# Altium project sensornode_v2.PrjPcb
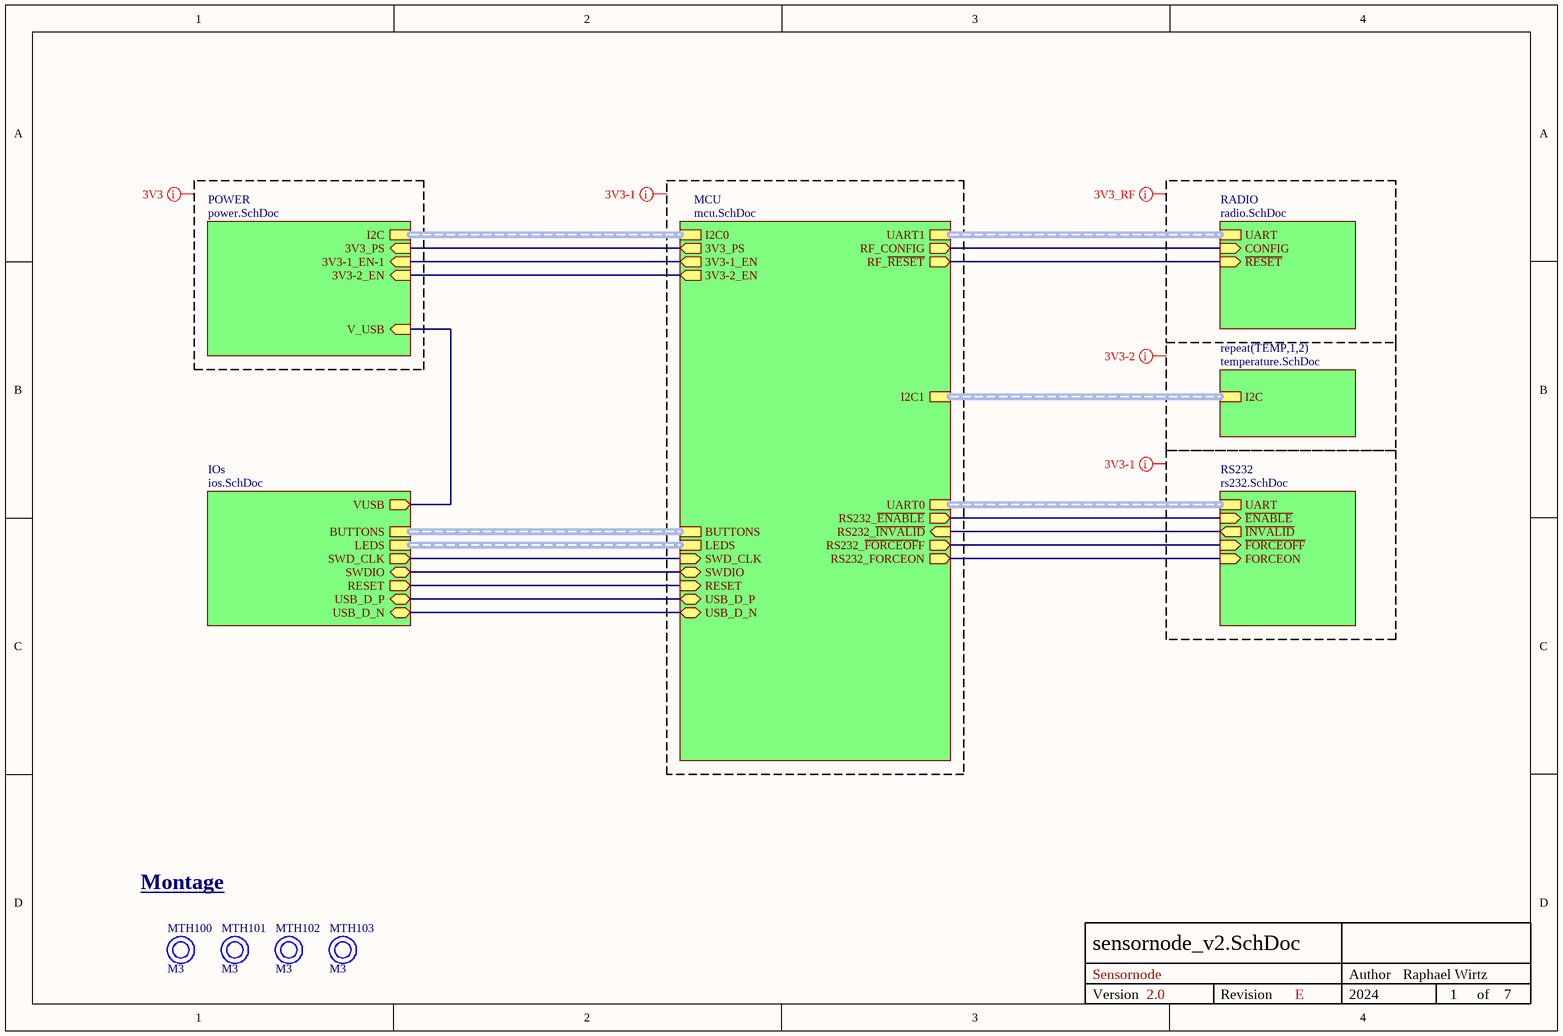
[diagram p0: sensornode_v2.SchDoc]
DateCustom: 2024; ProjectAuthorCustom: Raphael Wirtz; ProjectNameCustom: Sensornode; ProjectRevisionCustom: E; ProjectVersionCustom: 2.0
6 sheets, 113 parts. Net scope: hierarchical (ports join the sheet entries above them; power ports are global).
Board files: sensornode_poc_rtc.PcbDoc, sensornode_v2.PcbDoc
Sheets:
  sensornode_v2.SchDoc
    MCU = mcu.SchDoc
    POWER = power.SchDoc
    RADIO = radio.SchDoc
    TEMP1 = temperature.SchDoc
    TEMP2 = temperature.SchDoc
    IOs = ios.SchDoc

## Sheet sensornode_v2.SchDoc
size A4; DocumentNumber: 1; SheetNumber: 1; SheetTotal: 7

### Parts
MTH100  M3  (mechanical)
MTH101  M3  (mechanical)
MTH102  M3  (mechanical)
MTH103  M3  (mechanical)

### Sub-sheets
IOs = ios.SchDoc: RESET (out), USB_D_N (bidir), USB_D_P (bidir), LEDS (harness LED), BUTTONS (harness BUTTONS), SWDIO (bidir), SWD_CLK (out), VUSB (out)
MCU = mcu.SchDoc: I2C0 (harness I2C0), UART1 (harness UART0), UART0 (harness UART1), I2C1 (harness I2C1), RF_CONFIG (out), RF_~{RESET} (out), 3V3_PS (out), SWD_CLK (in), SWDIO (bidir), RESET (in), USB_D_N (bidir), USB_D_P (bidir), RS232_~{ENABLE} (out), RS232_~{INVALID} (in), BUTTONS (harness BUTTONS), LEDS (harness LED), 3V3-1_EN (out), 3V3-2_EN (out), RS232_~{FORCEOF}F (out), RS232_FORCEON (out)
POWER = power.SchDoc: 3V3_PS (in), I2C (harness I2C), V_USB (in), 3V3-2_EN (in), 3V3-1_EN-1 (in)
RADIO = radio.SchDoc: UART (harness UART), CONFIG (in), ~{RESET} (in)
repeat(TEMP,1,2) = temperature.SchDoc: I2C (harness I2C_Temp)
RS232 = rs232.SchDoc (file not in this document): UART (harness UART_RS232), ~{ENABLE} (in), ~{INVALID} (out), ~{FORCEOFF} (in), FORCEON (in)

### Nets
~{RF_RESET}: sheet MCU/RF_~{RESET}, sheet RADIO/~{RESET}
CONFIG: sheet MCU/RF_CONFIG, sheet RADIO/CONFIG
LED_2: sheet MCU/3V3-1_EN, sheet POWER/3V3-1_EN-1
POWER_3V3-2_EN: sheet MCU/3V3-2_EN, sheet POWER/3V3-2_EN
POWER_3V3_PS: sheet MCU/3V3_PS, sheet MCU/RS232_~{FORCEOF}F, sheet POWER/3V3_PS, sheet RS232/~{FORCEOFF}
RESET: sheet MCU/RESET, sheet IOs/RESET
RS232_~{ENABLE}: sheet MCU/RS232_~{ENABLE}, sheet RS232/~{ENABLE}
RS232_FORCEON: sheet MCU/RS232_FORCEON, sheet RS232/FORCEON
RS232_~{INVALID}: sheet MCU/RS232_~{INVALID}, sheet RS232/~{INVALID}
SWD_CLK: sheet MCU/SWD_CLK, sheet IOs/SWD_CLK
SWDIO: sheet MCU/SWDIO, sheet IOs/SWDIO
USB_D_N: sheet MCU/USB_D_N, sheet IOs/USB_D_N
USB_D_P: sheet MCU/USB_D_P, sheet IOs/USB_D_P
V_USB: sheet POWER/V_USB, sheet IOs/VUSB

### Buses and harness runs
harness sheet IOs/BUTTONS = sheet MCU/BUTTONS
harness sheet IOs/LEDS = sheet MCU/LEDS
harness sheet MCU/I2C0 = sheet POWER/I2C
harness sheet MCU/I2C1 = sheet repeat(TEMP,1,2)/I2C
harness sheet MCU/UART0 = sheet RS232/UART
harness sheet MCU/UART1 = sheet RADIO/UART

### Layout directives
net class 3V3: (no net found under the mark)
net class 3V3-2: (no net found under the mark)
net class 3V3-1: (no net found under the mark)

### Notes on the sheet
- Montage
- Author
- Version
- Revision
- of

### Library data of the parts
MTH100-MTH103 = MOUNT_TH: Value: M3

## Sheet mcu.SchDoc
size A3; DocumentNumber: 3; SheetNumber: 3; SheetTotal: 7
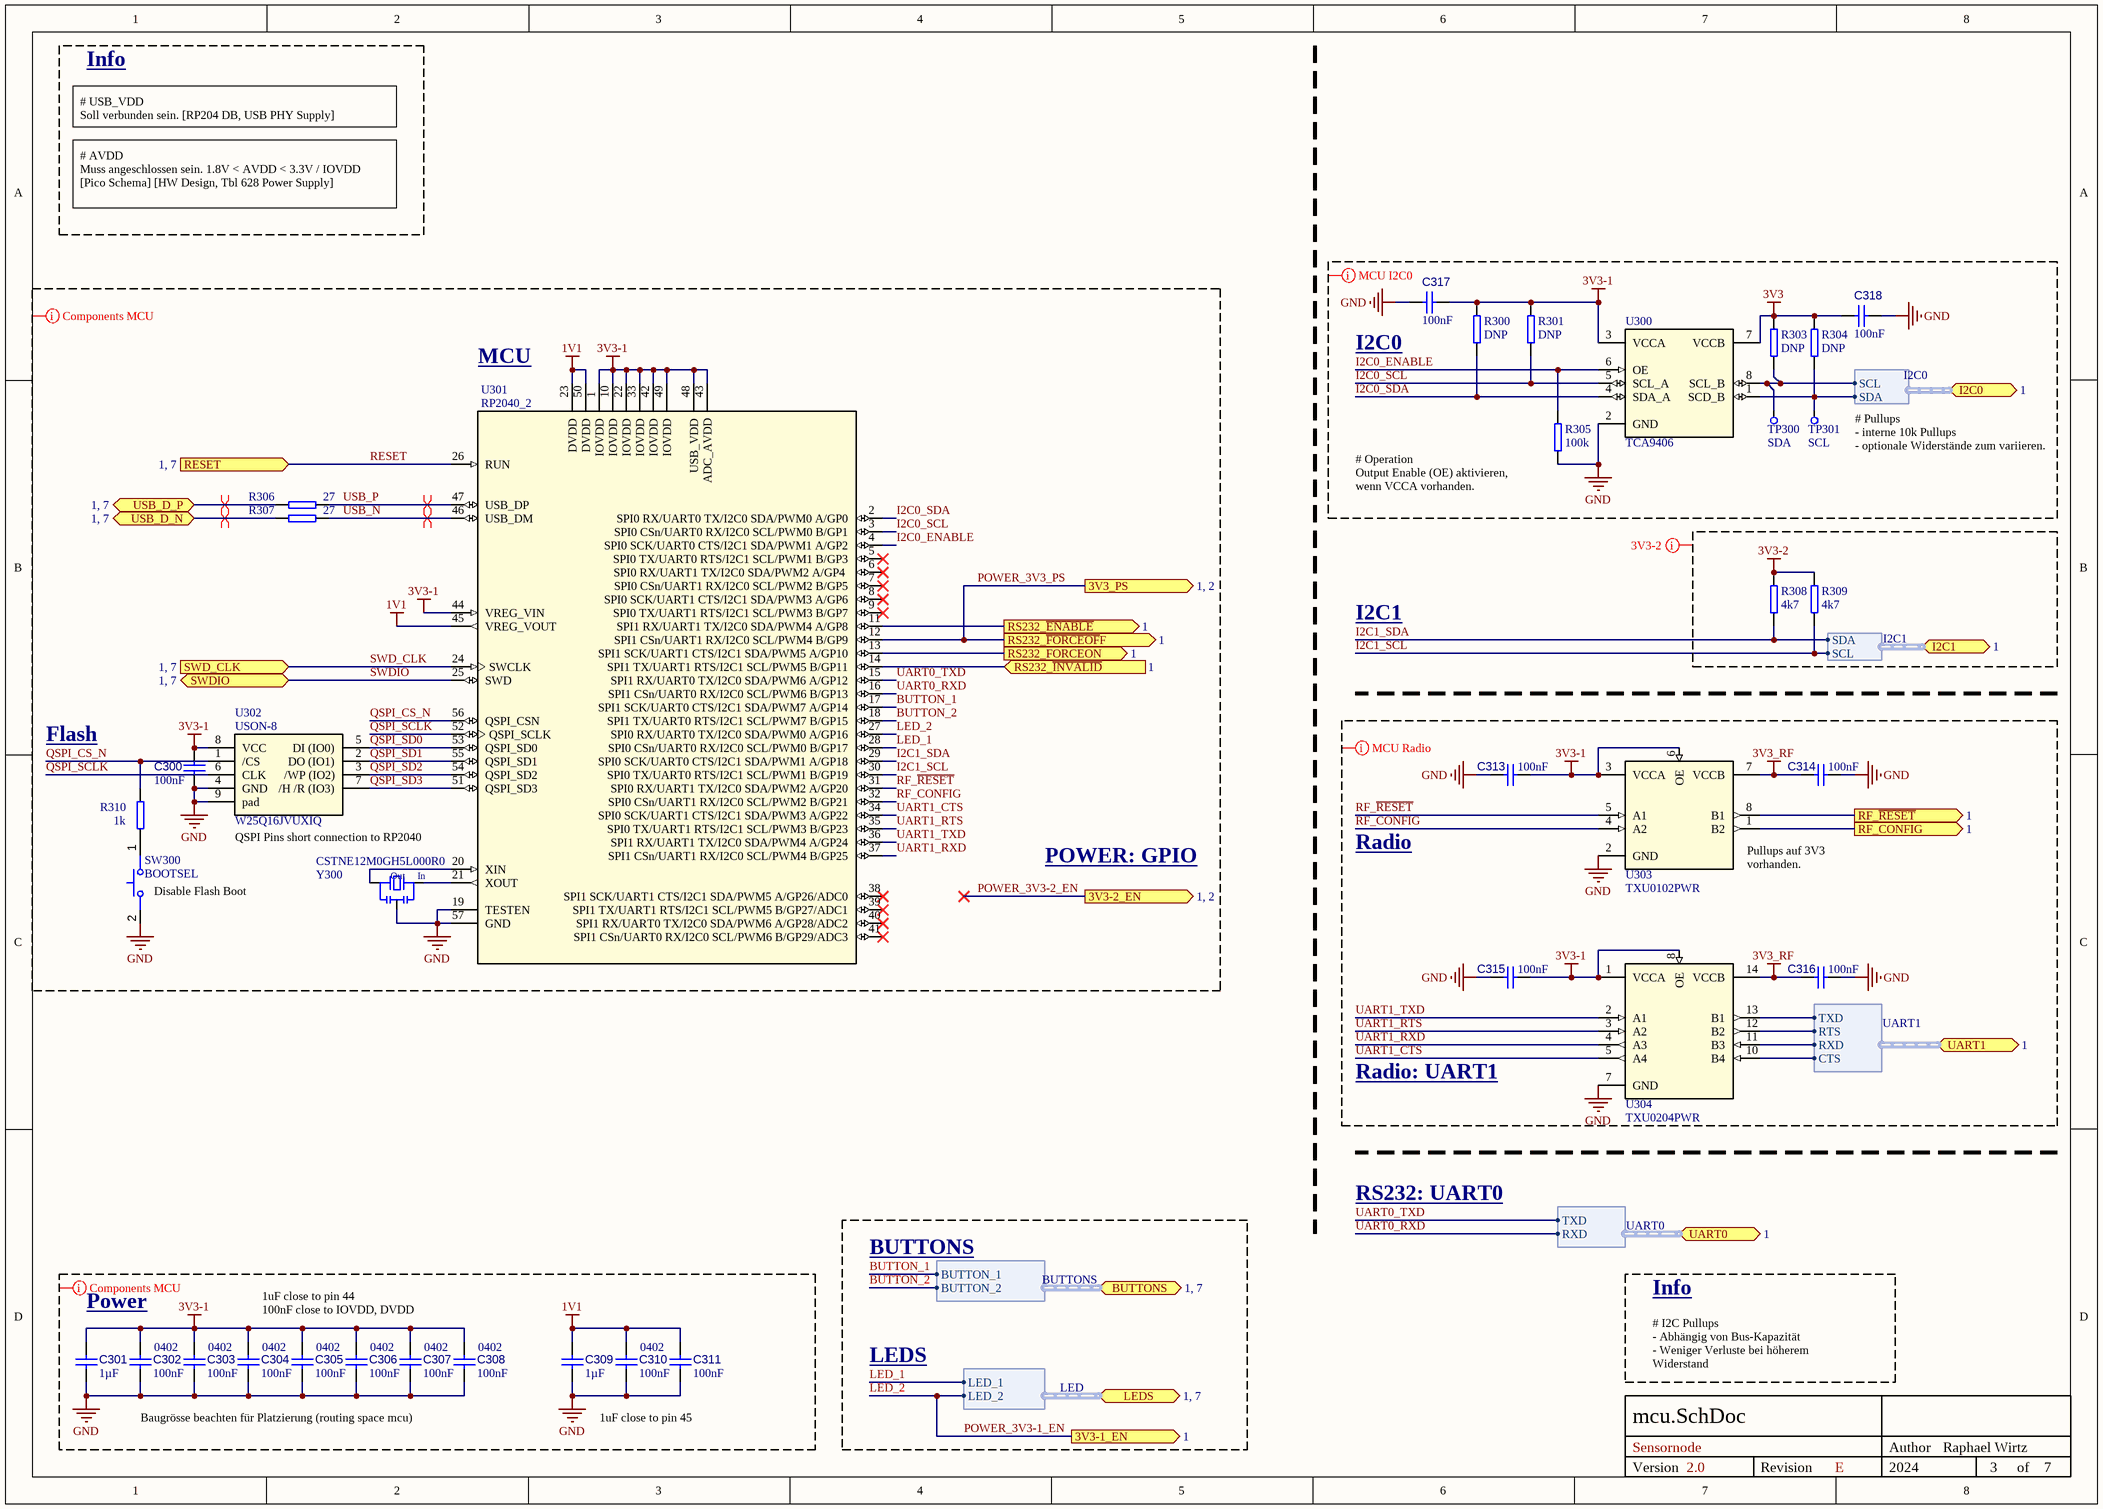
[diagram p1: mcu.SchDoc]

### Parts
C300  value 100nF  [0402]  (hidden comment: Capacitor 0402)
C301  1µF  [0402]
C302  value 100nF  [0402]  (hidden comment: Capacitor 0402)
C303  value 100nF  [0402]  (hidden comment: Capacitor 0402)
C304  value 100nF  [0402]  (hidden comment: Capacitor 0402)
C305  value 100nF  [0402]  (hidden comment: Capacitor 0402)
C306  value 100nF  [0402]  (hidden comment: Capacitor 0402)
C307  value 100nF  [0402]  (hidden comment: Capacitor 0402)
C308  value 100nF  [0402]  (hidden comment: Capacitor 0402)
C309  1µF  [0402]
C310  value 100nF  [0402]  (hidden comment: Capacitor 0402)
C311  value 100nF  [0402]  (hidden comment: Capacitor 0402)
C313  value 100nF  [0603]
C314  value 100nF  [0603]
C315  value 100nF  [0603]
C316  value 100nF  [0603]
C317  value 100nF  [0603]
C318  value 100nF  [0603]
R300  DNP  [0603]
R301  DNP  [0603]
R303  DNP  [0603]
R304  DNP  [0603]
R305  100k  [0603]
R306  27  [0603]
R307  27  [0603]
R308  4k7  [0603]
R309  4k7  [0603]
R310  1k  [0603]
SW300  BOOTSEL  [SWITCH_B3FS1010P]
TP300  Name: SDA  [TP+245X165]  (hidden comment: TP_SMD)
TP301  Name: SCL  [TP+245X165]  (hidden comment: TP_SMD)
U300  TCA9406  [VSSOP_SOP50P310X90-8N]
U301  RP2040_2  [QFN40P700X700X90-57N]
U302  W25Q16JVUXIQ  Case: USON-8  [SON50P300X200X60-9N]
U303  TXU0102PWR  [VFSOP-8]
U304  TXU0204PWR  [TSSOP-14]
Y300  CSTNE12M0GH5L000R0  [OSC_CSTNE12M0GH5L000R0]

### Ports
3V3-1_EN (out, see 1), 3V3-2_EN (out, see 1, 2), 3V3_PS (out, see 1, 2), BUTTONS (bidir, harness BUTTONS, see 1, 7), I2C0 (bidir, harness I2C0, see 1), I2C1 (bidir, harness I2C1, see 1), LEDS (bidir, harness LED, see 1, 7), RESET (in, see 1, 7), RF_CONFIG (out, see 1), RF_~{RESET} (out, see 1), RS232_FORCEON (out, see 1), RS232_~{ENABLE} (out, see 1), RS232_~{FORCEOF}F (out, see 1), RS232_~{INVALID} (in, see 1), SWD_CLK (in, see 1, 7), SWDIO (bidir, see 1, 7), UART0 (bidir, harness UART0, see 1), UART1 (bidir, harness UART1, see 1), USB_D_N (bidir, see 1, 7), USB_D_P (bidir, see 1, 7)

### Harnesses
I2C1: SDA, SCL
I2C0: SDA, SCL
UART0: TXD, RXD
UART1: CTS, RTS, TXD, RXD
BUTTONS: BUTTON_1, BUTTON_2
LED: LED_2, LED_1

### Nets
1V1: C309.1 C310.1 C311.1 U301.23(DVDD) U301.45(VREG_VOUT) U301.50(DVDD)
3V3: C318.2 R303.1 R304.1 U300.7(VCCB)
3V3-1: C300.1 C301.1 C302.1 C303.1 C304.1 C305.1 C306.1 C307.1 C308.1 C313.2 C315.2 C317.1 R300.1 R301.1 U300.3(VCCA) U301.1(IOVDD) U301.10(IOVDD) U301.22(IOVDD) U301.33(IOVDD) U301.42(IOVDD) U301.43(ADC_AVDD) U301.44(VREG_VIN) U301.48(USB_VDD) U301.49(IOVDD) U302.8(VCC) U303.3(VCCA) U303.6(OE) U304.1(VCCA) U304.8(OE)
3V3-2: R308.1 R309.1
3V3_RF: C314.1 C316.1 U303.7(VCCB) U304.14(VCCB)
GND: C300.2 C301.2 C302.2 C303.2 C304.2 C305.2 C306.2 C307.2 C308.2 C309.2 C310.2 C311.2 C313.1 C314.2 C315.1 C316.2 C317.2 C318.1 R305.2 SW300.2 U300.2(GND) U301.19(TESTEN) U301.57(GND) U302.4(GND) U302.9(pad) U303.2(GND) U304.7(GND) Y300.2(GND)
~{RF_RESET}: U303.8(B1) ; port RF_~{RESET}
BUTTON_1: U301.17(SPI1_SCK/UART0_CTS/I2C1_SDA/PWM7_A/GP14) ; port BUTTONS.BUTTON_1
BUTTON_2: U301.18(SPI1_TX/UART0_RTS/I2C1_SCL/PWM7_B/GP15) ; port BUTTONS.BUTTON_2
CONFIG: U303.1(B2) ; port RF_CONFIG
I2C0_ENABLE: R305.1 U300.6(OE) U301.4(SPI0_SCK/UART0_CTS/I2C1_SDA/PWM1_A/GP2)
I2C0_SCL: R301.2 U300.5(SCL_A) U301.3(SPI0_CSn/UART0_RX/I2C0_SCL/PWM0_B/GP1)
I2C0_SDA: R300.2 U300.4(SDA_A) U301.2(SPI0_RX/UART0_TX/I2C0_SDA/PWM0_A/GP0)
I2C1_SCL: R309.2 U301.30(SPI0_TX/UART0_RTS/I2C1_SCL/PWM1_B/GP19) ; port I2C1.SCL
I2C1_SDA: R308.2 U301.29(SPI0_SCK/UART0_CTS/I2C1_SDA/PWM1_A/GP18) ; port I2C1.SDA
LED_1: U301.28(SPI0_CSn/UART0_RX/I2C0_SCL/PWM0_B/GP17) ; port LEDS.LED_1
LED_2: U301.27(SPI0_RX/UART0_TX/I2C0_SDA/PWM0_A/GP16) ; port 3V3-1_EN, port LEDS.LED_2  [also labelled POWER_3V3-1_EN]
POWER_3V3_PS: U301.12(SPI1_CSn/UART1_RX/I2C0_SCL/PWM4_B/GP9) ; port 3V3_PS, port RS232_~{FORCEOF}F
QSPI_CS_N: R310.2 U301.56(QSPI_CSN) U302.1(/CS)
QSPI_SCLK: U301.52(QSPI_SCLK) U302.6(CLK)
QSPI_SD0: U301.53(QSPI_SD0) U302.5(DI_(IO0))
QSPI_SD1: U301.55(QSPI_SD1) U302.2(DO_(IO1))
QSPI_SD2: U301.54(QSPI_SD2) U302.3(/WP_(IO2))
QSPI_SD3: U301.51(QSPI_SD3) U302.7(/H_/R_(IO3))
RESET: U301.26(RUN) ; port RESET
RF_CONFIG: U301.32(SPI0_CSn/UART1_RX/I2C0_SCL/PWM2_B/GP21) U303.4(A2)
RF_~{RESET}: U301.31(SPI0_RX/UART1_TX/I2C0_SDA/PWM2_A/GP20) U303.5(A1)
RF_RXD: U304.11(B3) ; port UART1.RXD
RF_TXD: U304.13(B1) ; port UART1.TXD
RS232_~{ENABLE}: U301.11(SPI1_RX/UART1_TX/I2C0_SDA/PWM4_A/GP8) ; port RS232_~{ENABLE}
RS232_FORCEON: U301.13(SPI1_SCK/UART1_CTS/I2C1_SDA/PWM5_A/GP10) ; port RS232_FORCEON
RS232_~{INVALID}: U301.14(SPI1_TX/UART1_RTS/I2C1_SCL/PWM5_B/GP11) ; port RS232_~{INVALID}
SWD_CLK: U301.24(SWCLK) ; port SWD_CLK
SWDIO: U301.25(SWD) ; port SWDIO
UART0_RXD: U301.16(SPI1_CSn/UART0_RX/I2C0_SCL/PWM6_B/GP13) ; port UART0.RXD
UART0_TXD: U301.15(SPI1_RX/UART0_TX/I2C0_SDA/PWM6_A/GP12) ; port UART0.TXD
UART1_CTS: U301.34(SPI0_SCK/UART1_CTS/I2C1_SDA/PWM3_A/GP22) U304.5(A4)
UART1_RTS: U301.35(SPI0_TX/UART1_RTS/I2C1_SCL/PWM3_B/GP23) U304.3(A2)
UART1_RXD: U301.37(SPI1_CSn/UART1_RX/I2C0_SCL/PWM4_B/GP25) U304.4(A3)
UART1_TXD: U301.36(SPI1_RX/UART1_TX/I2C0_SDA/PWM4_A/GP24) U304.2(A1)
USB_D_N: R307.2 ; port USB_D_N
USB_D_P: R306.2 ; port USB_D_P
USB_N: R307.1 U301.46(USB_DM)
USB_P: R306.1 U301.47(USB_DP)
NetR303_2: R303.2 TP300.1 U300.8(SCL_B) ; port I2C0.SCL
NetR304_2: R304.2 TP301.1 U300.1(SCD_B) ; port I2C0.SDA
NetR310_1: R310.1 SW300.1
NetU301_20: U301.20(XIN) Y300.3
NetU301_21: U301.21(XOUT) Y300.1
NetU304_10: U304.10(B4) ; port UART1.CTS
NetU304_12: U304.12(B2) ; port UART1.RTS

Not connected (* = marked no-connect by the designer): U301 5(SPI0_TX/UART0_RTS/I2C1_SCL/PWM1_B/GP3)* 6(SPI0_RX/UART1_TX/I2C0_SDA/PWM2_A/GP4)* 7(SPI0_CSn/UART1_RX/I2C0_SCL/PWM2_B/GP5)* 8(SPI0_SCK/UART1_CTS/I2C1_SDA/PWM3_A/GP6)* 9(SPI0_TX/UART1_RTS/I2C1_SCL/PWM3_B/GP7)* 38(SPI1_SCK/UART1_CTS/I2C1_SDA/PWM5_A/GP26/ADC0)* 39(SPI1_TX/UART1_RTS/I2C1_SCL/PWM5_B/GP27/ADC1)* 40(SPI1_RX/UART0_TX/I2C0_SDA/PWM6_A/GP28/ADC2)* 41(SPI1_CSn/UART0_RX/I2C0_SCL/PWM6_B/GP29/ADC3)*

### Layout directives
differential pair: USB_D_N, USB_D_P, USB_N, USB_P
net class 3V3-2: 3V3-2
CompClassName: MCU_MCU: 1V1, 3V3-1, BUTTON_1, BUTTON_2, GND, I2C0_ENABLE, I2C0_SCL, I2C0_SDA, I2C1_SCL, I2C1_SDA, LED_1, LED_2, POWER_3V3-2_EN, POWER_3V3_PS, QSPI_CS_N, QSPI_SCLK, QSPI_SD0, QSPI_SD1, QSPI_SD2, QSPI_SD3, RESET, RF_CONFIG, RF_~{RESET}, SWD_CLK, SWDIO, UART0_RXD, UART0_TXD, UART1_CTS, UART1_RTS, UART1_RXD, UART1_TXD, USB_N, USB_P
CompClassName: MCU_I2C0: 3V3, 3V3-1, GND, I2C0_ENABLE, I2C0_SCL, I2C0_SDA
CompClassName: MCU_RADIO: 3V3-1, 3V3_RF, GND, RF_CONFIG, RF_~{RESET}, UART1_CTS, UART1_RTS, UART1_RXD, UART1_TXD

### Notes on the sheet
- Info
- # USB_VDD
  Soll verbunden sein. [RP204 DB, USB PHY Supply]
- # AVDD
  Muss angeschlossen sein. 1.8V < AVDD < 3.3V / IOVDD
  [Pico Schema] [HW Design, Tbl 628 Power Supply]
- (near U301) MCU
- (near C317) I2C0
- (near R305) # Operation
  Output Enable (OE) aktivieren, wenn VCCA vorhanden.
- (near TP301) # Pullups
  - interne 10k Pullups
  - optionale Widerstände zum variieren.
- I2C1
- Flash
- QSPI Pins short connection to RP2040
- Radio
- (near SW300) Disable Flash Boot
- POWER: GPIO
- (near U303) Pullups auf 3V3 vorhanden.
- Radio: UART1
- BUTTONS
- RS232: UART0
- Power
- 1uF close to pin 44
  100nF close to IOVDD, DVDD
- LEDS
- # I2C Pullups
  - Abhängig von Bus-Kapazität
  - Weniger Verluste bei höherem Widerstand
- Baugrösse beachten für Platzierung (routing space mcu)
- 1uF close to pin 45
- Author
- Version
- Revision
- of
- (in symbol Crystal_3) Out; In

### Library data of the parts
C300-C311 C313-C318 = C: Manufacturer: Kyocera AVX; Manufacturer Part Number: 04026D105KAT2A; Voltage Rating: 6.3V; Tolerance: 10%; Mounting Technology: SM; Pins: 2; Case/Package: 0402; RoHS Compliant: True; Max Operating Temperature: 85°C; Component Type: Capacitors
  C301 C309: Value: 1µF
R300 R301 R303-R310 = R?: Normaler Widerstand
SW300 = SW_TACTILE_1
TP300 TP301 = Testpoint
U300 = IC_TCA9406: 2-bit bidirectional 1MHz I2C/SMBus voltage level translator with internal pull-up resistor
U301 = RP2040_2: RP2040 chip for Raspberry Pi Pico - ARMÂ® CortexÂ®-M0+ MCU 32-Bit; Check_prices: https://www.snapeda.com/parts/RP2040/Raspberry+Pi/view-part/?ref=eda; Value: *; Availability: In Stock; MP: RP2040; Price: None; Package: None; SnapEDA_Link: https://www.snapeda.com/parts/RP2040/Raspberry+Pi/view-part/?ref=snap; Purchase-URL: https://pricing.snapeda.com/search/part/RP2040/?ref=eda; MF: Raspberry Pi
U302 = W25Q16JVUXIQ: No Description Available; Mfr_Name: Winbond; RefDes: RefDes; Type: Type
U303 = IC_TXU0102: Dual-channel fixed multidirectional level shifter; Supplier 1: Mouser; Supplier Part Number 1: 595-TXU0102DCUR
U304 = IC_TXU0204_TSSOP: Four-channel fixed multidirectional level shifter
Y300 = Crystal_3: SMT Crystal; Value: CSTNE12M0GH5L000R0

## Sheet power.SchDoc
size A4; DocumentNumber: 2; SheetNumber: 2; SheetTotal: 7
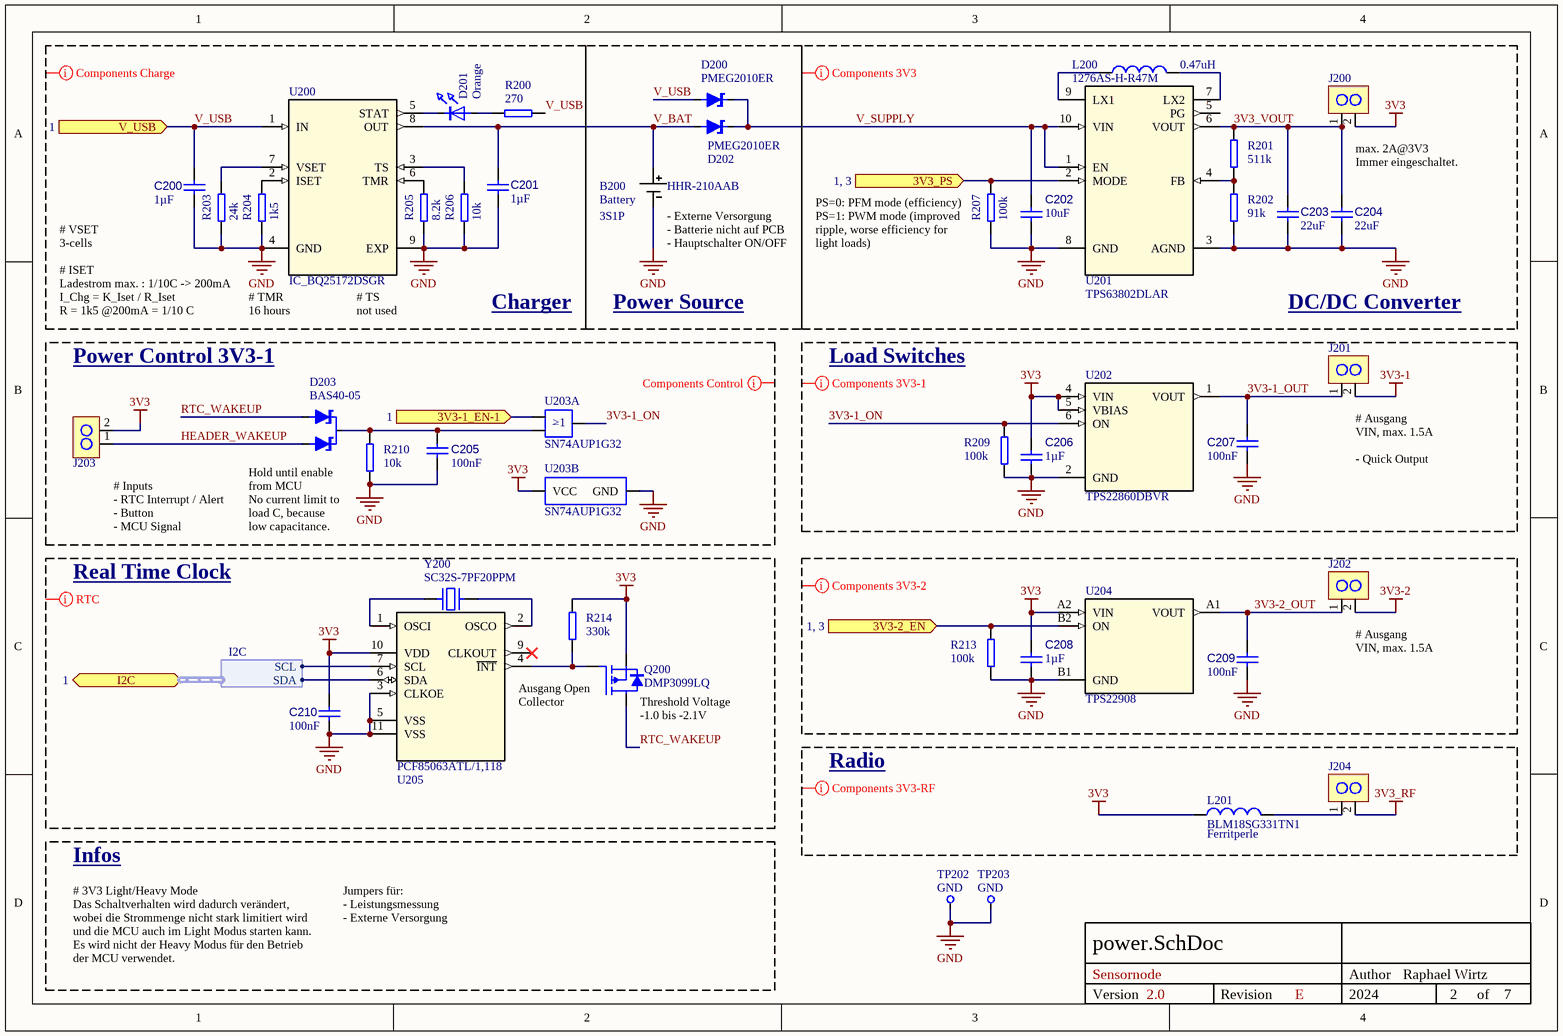
[diagram p2: power.SchDoc]

### Parts
B200  Battery  battery_config: 3S1P  product: HHR-210AAB  [JST-S2B-PH-K-S_V - Cloned]
C200  1µF  [0402]
C201  1µF  [0402]
C202  value 10uF  [0603]  (hidden comment: Capacitor 0402)
C203  value 22uF  [0603]  (hidden comment: Capacitor 0603)
C204  value 22uF  [0603]  (hidden comment: Capacitor 0603)
C205  100nF  [0603]
C206  1µF  [0603]
C207  100nF  [0603]
C208  1µF  [0603]
C209  100nF  [0603]
C210  value 100nF  [0402]  (hidden comment: Capacitor 0402)
D200  PMEG2010ER  [SODFL3517X110N]
D201  Orange  [0603-Diode]
D202  PMEG2010ER  [SODFL3517X110N]
D203  BAS40-05  [SOT-23]
J200  HEADER_2x1_TD  [HEADER_2_RM_2.54]  (value not drawn)
J201  HEADER_2x1_TD  [HEADER_2_RM_2.54]  (value not drawn)
J202  HEADER_2x1_TD  [HEADER_2_RM_2.54]  (value not drawn)
J203  HEADER_2x1_TD  [HEADER_2_RM_2.54]  (value not drawn)
J204  HEADER_2x1_TD  [HEADER_2_RM_2.54]  (value not drawn)
L200  0.47uH  name: 1276AS-H-R47M  [FP-XFL4015-MFG]
L201  BLM18SG331TN1  Info: Ferritperle  [1608X65N_BEADC]
Q200  DMP3099LQ  [SOT-23 - FET]
R200  270  [0603]
R201  511k  [0603]
R202  91k  [0603]
R203  24k  [0603]
R204  1k5  [0603]
R205  8.2k  [0603]
R206  10k  [0603]
R207  100k  [0603]
R209  100k  [0603]
R210  10k  [0603]
R213  100k  [0603]
R214  330k  [0603]
TP202  Name: GND  [TP+245X165]  (hidden comment: TP_SMD)
TP203  Name: GND  [TP+245X165]  (hidden comment: TP_SMD)
U200  IC_BQ25172DSGR  [IC_BQ25172DSGR]
U201  TPS63802DLAR  [VREG_TPS63802DLAR]
U202  TPS22860DBVR  [SOT95P280X145-6N]
U203  SN74AUP1G32  [SOT23-5]  (parts A,B of 2)
U204  TPS22908  [BGA4C50P2X2_88X88X62N]
U205  PCF85063ATL/1,118  [10-DFN(2.6X2.6)]
Y200  SC32S-7PF20PPM  [SC32S7PF20PPM]

### Blocks framed on the sheet
Power Source: B200 D200 D202

### Ports
3V3-1_EN-1 (in, see 1), 3V3-2_EN (in, see 1, 3), 3V3_PS (in, see 1, 3), I2C (bidir, harness I2C, see 1), V_USB (in, see 1)

### Harnesses
I2C: SCL, SDA

### Nets
3V3: C206.2 C208.2 C210.2 J200.2 J203.2 L201.1 Q200.S(SOURCE) R214.2 U202.4(VIN) U202.5(VBIAS) U203.5(VCC) U204.A2(VIN) U205.10(VDD)
3V3-1: J201.2
3V3-2: J202.2
3V3_RF: J204.2
GND: B200.2(-) C200.1 C201.1 C202.1 C203.1 C204.1 C205.1 C206.1 C207.1 C208.1 C209.1 C210.1 R202.2 R203.2 R204.2 R205.2 R206.2 R207.1 R209.2 R210.1 R213.2 TP202.1 TP203.1 U200.4(GND) U200.9(EXP) U201.3(AGND) U201.8(GND) U202.2(GND) U203.3(GND) U204.B1(GND) U205.3(CLKOE) U205.5(VSS) U205.11(VSS)
3V3-1_ON: R209.1 U202.6(ON) U203.4(Y)
3V3-1_OUT: C207.2 J201.1 U202.1(VOUT)
3V3-2_OUT: C209.2 J202.1 U204.A1(VOUT)
3V3_VOUT: C203.2 C204.2 J200.1 R201.1 U201.6(VOUT)
HEADER_WAKEUP: D203.2(A) J203.1
LED_2: U203.1(A) ; port 3V3-1_EN-1
POWER_3V3-2_EN: R213.1 U204.B2(ON) ; port 3V3-2_EN
POWER_3V3_PS: R207.2 U201.2(MODE) ; port 3V3_PS
RTC_WAKEUP: D203.1(A) Q200.D(DRAIN)
V_BAT: B200.1(+) C201.2 D202.A U200.8(OUT)
V_SUPPLY: C202.2 D200.K D202.K U201.1(EN) U201.10(VIN)
V_USB: C200.2 D200.A R200.2 U200.1(IN) ; port V_USB
NetC205_2: C205.2 D203.3(K) R210.2 U203.2(B)
NetD201_A: D201.A R200.1
NetD201_K: D201.K U200.5(STAT)
NetJ204_1: J204.1 L201.2
NetL200_1: L200.1 U201.9(LX1)
NetL200_2: L200.2 U201.7(LX2)
NetQ200_G: Q200.G(GATE) R214.1 U205.4(~{INT})
NetR201_2: R201.2 R202.1 U201.4(FB)
NetR203_1: R203.1 U200.7(VSET)
NetR204_1: R204.1 U200.2(ISET)
NetR205_1: R205.1 U200.6(TMR)
NetR206_1: R206.1 U200.3(TS)
NetR303_2: U205.7(SCL) ; port I2C.SCL
NetR304_2: U205.6(SDA) ; port I2C.SDA
NetU205_1: U205.1(OSCI) Y200.1
NetU205_2: U205.2(OSCO) Y200.2

Not connected (* = marked no-connect by the designer): U201 5(PG); U205 9(CLKOUT)*

### Layout directives
CompClassName: POWER_3V3-2: 3V3, 3V3-2, 3V3-2_OUT, GND
CompClassName: POWER_3V3-1: 3V3, 3V3-1, 3V3-1_ON, 3V3-1_OUT, GND
CompClassName: RTC: 3V3, GND, RTC_WAKEUP
CompClassName: POWER_3V3: 3V3, 3V3_VOUT, GND, V_SUPPLY
CompClassName: POWER_Charge: GND, V_USB
CompClassName: POWER_3V3-RF: 3V3, 3V3_RF
CompClassName: POWER_CONTROL: 3V3, 3V3-1_ON, GND, HEADER_WAKEUP, RTC_WAKEUP

### Notes on the sheet
- max. 2A@3V3
  Immer eingeschaltet.
- # VSET
  3-cells
- (near B200) - Externe Versorgung
  - Batterie nicht auf PCB
  - Hauptschalter ON/OFF
- (near R207) PS=0: PFM mode (efficiency)
  PS=1: PWM mode (improved ripple, worse efficiency for light loads)
- # ISET
  Ladestrom max. : 1/10C -> 200mA
  I_Chg = K_Iset / R_Iset
  R = 1k5 @200mA = 1/10 C
- (near U200) # TMR
  16 hours
- (near U200) # TS
  not used
- Charger
- DC/DC Converter
- Power Control 3V3-1
- Load Switches
- Hold until enable from MCU
- (near J201) # Ausgang
  VIN, max. 1.5A
  - Quick Output Discharge (QOD)
- Real Time Clock
- (near J203) # Inputs
  - RTC Interrupt / Alert
  - Button
  - MCU Signal
- No current limit to load C, because low capacitance.
- (near J202) # Ausgang
  VIN, max. 1.5A
- (near Q200) Ausgang Open Collector
- (near Q200) Threshold Voltage -1.0 bis -2.1V
- Radio
- Infos
- # 3V3 Light/Heavy Mode
  Das Schaltverhalten wird dadurch verändert, wobei die Strommenge nicht stark limitiert wird und die MCU auch im Light Modus starten kann. Es wird nicht der Heavy Modus für den Betrieb der MCU verwendet.
- Jumpers für:
  - Leistungsmessung
  - Externe Versorgung
- Author
- Version
- Revision
- of
- (in symbol Gatter OR1x2_1 SN74AUP1G32, part A) >1; _

### Library data of the parts
C200 C201 C203-C210 = C: Manufacturer: TDK; Manufacturer Part Number: C1005X6S0J105K050BC; Manufacturer: Murata; Manufacturer Part Number: GRM155R60J105KE19D; Manufacturer: Kyocera AVX; Manufacturer Part Number: 04026D105KAT2A; Voltage Rating: 6.3V; Tolerance: 10%; Mounting Technology: SM; Pins: 2; Case/Package: 0402; RoHS Compliant: True; Max Operating Temperature: 85°C; Component Type: Capacitors
  C200 C201 C206 C208: Value: 1µF
  C205 C207 C209: Value: 100nF
C202 = C: Manufacturer: TDK; Manufacturer Part Number: C1005X6S0J105K050BC; Manufacturer: Murata; Manufacturer Part Number: GRM155R60J105KE19D; Manufacturer: Kyocera AVX; Manufacturer Part Number: 04026D105KAT2A; Voltage Rating: 6.3V; Tolerance: 10%; Voltage: 25; Mounting Technology: SM; Pins: 2; Case/Package: 0402; RoHS Compliant: True; Max Operating Temperature: 85°C; Component Type: Capacitors
D200 D202 = Schotky_1: Value: PMEG2010ER; Supplier 1: Future Electronics; Supplier Part Number 1: 7040635
D201 = LED_1
D203 = Schotky_BAS40-5: Value: BAS40-05; Supplier 1: Mouser; Supplier Part Number 1: 726-BAS4005E6327HTSA
L200 = L?: Supplier: Mouser; Supplier Part Number: 81-1276AS-H-R47MP2; Supplier 1: Farnell; Supplier Part Number 1: 2289211
L201 = L?: 330 Ohms @ 100 MHz 1 Power Line Ferrite Bead 0603 (1608 Metric) 1.5A 70mOhm; Supplier 1: Mouser; Supplier Part Number 1: 81-BLM18SG331TN1D
Q200 = MOSFET P
R200-R207 R209 R210 R213 R214 = R?: Normaler Widerstand
  R200: Value: 270
  R202: Supplier: Mouser; Supplier Part Number: 595-TPS63802DLAR
TP202 TP203 = Testpoint
U200 = IC_BQ25172DSGR: Charge IC. 0.8-A, one- to six-cell NiMH stand-alone linear charger in a QFN package; MF: Texas Instruments; SnapEDA_Link: https://www.snapeda.com/parts/BQ25172DSGR/Texas+Instruments/view-part/?ref=snap; Package: None; Value: *; MP: BQ25172DSGR; Check_prices: https://www.snapeda.com/parts/BQ25172DSGR/Texas+Instruments/view-part/?ref=eda
U201 = TPS63802DLAR: MF: Richtek USA; MP: RT6150B-33GQW; SnapEDA_Link: https://www.snapeda.com/parts/RT6150B-33GQW/Richtek+USA+Inc./view-part/?ref=snap; Package: WFDFN-10 Richtek; Value: *; Check_prices: https://www.snapeda.com/parts/RT6150B-33GQW/Richtek+USA+Inc./view-part/?ref=eda
U202 = TPS22860DBVR: 0.73-?, 5-V, ultra-low leakage load switch 6-SOT-23 -40 to 85; MF: Texas Instruments; MP: TPS22860DBVR; SnapEDA_Link: https://www.snapeda.com/parts/TPS22860DBVR/Texas%20Instruments/view-part/473340/?ref=snap; Texas_Instruments-Purchase-URL: https://snapeda.com/shop?store=Texas+Instruments&id=473340; Value: *; Package: SOT-23-6 Texas Instruments; Digi-Key_Part_Number: 296-43982-1-ND
U203 = Gatter OR1x2_1 SN74AUP1G32: Value: SN74AUP1G32; Package: SOT-353; Distributor: Farnell; Distributor Nr.: 1085242; Supplier 1: Mouser; Supplier Part Number 1: 595-SN74AUP1G32DCKR
U204 = TPS22908: 3.6-V, 1-A, 28-mΩ On-Resistance Load Switch with Controlled Rise Time; MP: TPS22860DBVR; MF: Texas Instruments; SnapEDA_Link: https://www.snapeda.com/parts/TPS22860DBVR/Texas%20Instruments/view-part/473340/?ref=snap; Texas_Instruments-Purchase-URL: https://snapeda.com/shop?store=Texas+Instruments&id=473340; Value: TPS22908; Package: SOT-23-6 Texas Instruments; Digi-Key_Part_Number: 296-43982-1-ND
U205 = PCF85063ATL/1,118: Real Time Clock (RTC) IC Clock/Calendar - IÂ²C, 2-Wire Serial 10-XFDFN Exposed Pad; MF: NXP USA; SnapEDA_Link: https://www.snapeda.com/parts/PCF85063ATL/1,118/NXP+USA+Inc./view-part/?ref=snap; Availability: In Stock; MP: PCF85063ATL/1,118; Price: None; Package: DFN-10 NXP Semiconductors; Purchase-URL: https://pricing.snapeda.com/search/part/PCF85063ATL/1,118/?ref=eda; Value: *; Check_prices: https://www.snapeda.com/parts/PCF85063ATL/1,118/NXP+USA+Inc./view-part/?ref=eda
Y200 = Crystal_1: Crystal; Value: SC32S-7PF20PPM
J200-J204 = HEADER_2x1_TD: Supplier: Mouser; Supplier Part Number: 471-SMARACONNECTORWP

## Sheet radio.SchDoc
size A4; DocumentNumber: 4; SheetNumber: 4; SheetTotal: 7
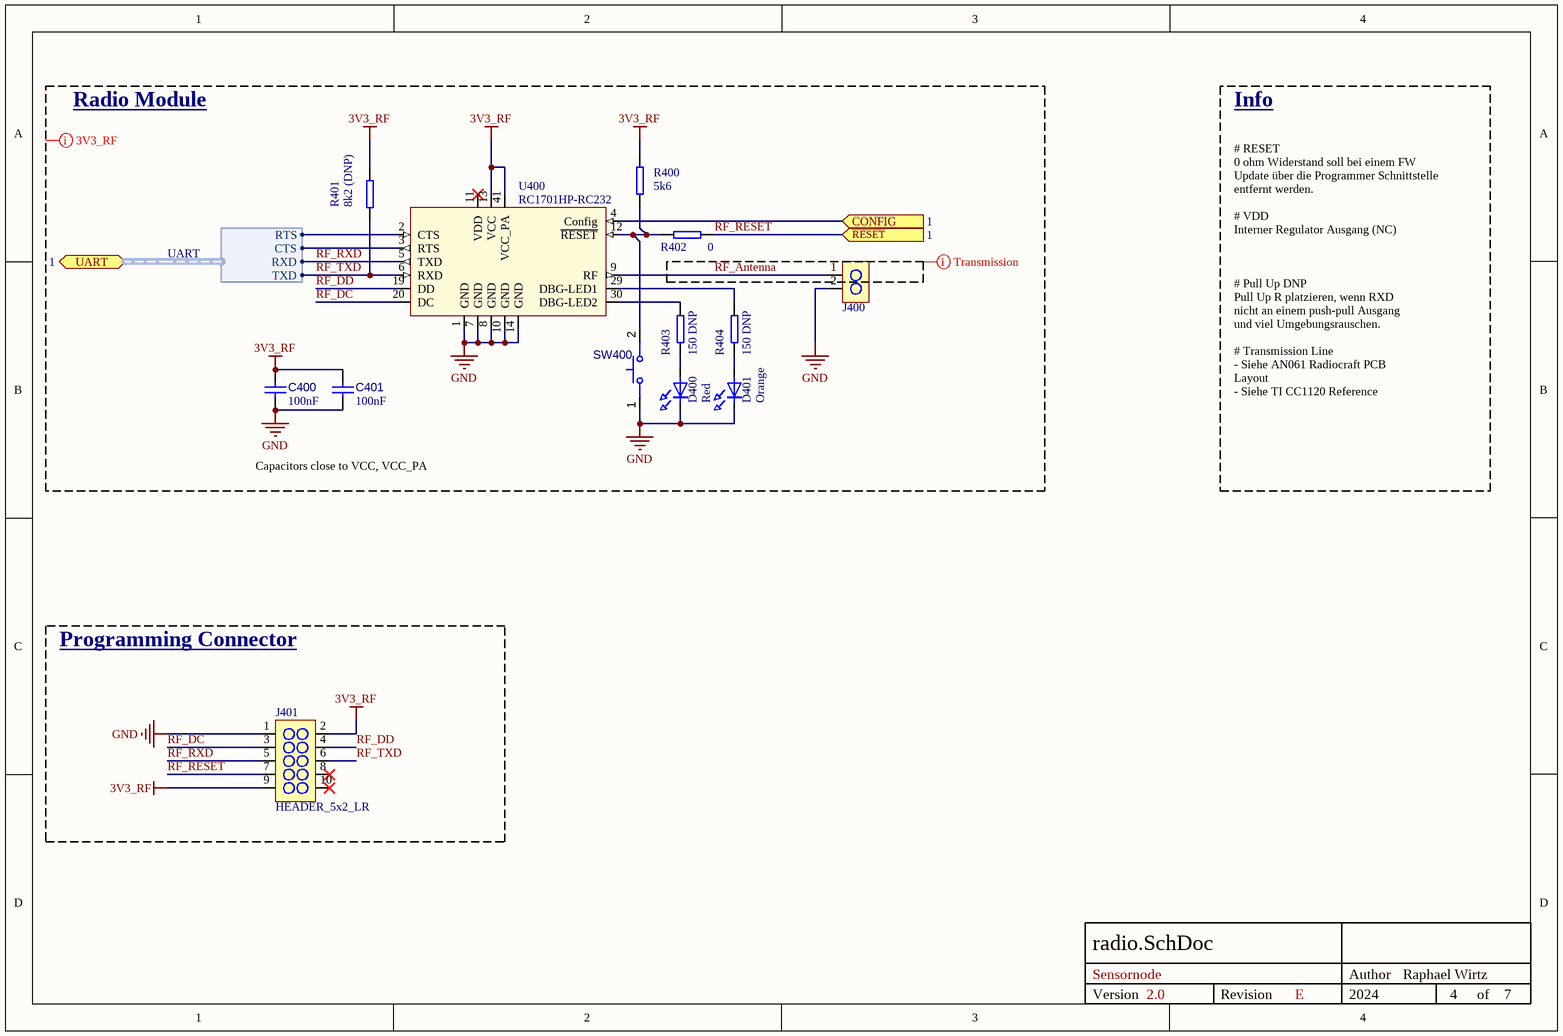
[diagram p3: radio.SchDoc]

### Parts
C400  value 100nF  [0603]
C401  value 100nF  [0603]
D400  Red  [0603-Diode]
D401  Orange  [0603-Diode]
J400  RF_LPRS_x2  [SMARACONNECTOR]  (value not drawn)
J401  HEADER_5x2_LR  [HEADER_SMD_1.27]
R400  5k6  [0603]
R401  8k2 (DNP)  [0603]
R402  0  [0603]
R403  150 DNP  [0603]
R404  150 DNP  [0603]
SW400  B3U-1000P-B  [OMRON-B3U-1000P-2-B_V]  (value not drawn)
U400  RC1701HP-RC232  [RF_RC1701HP]

### Blocks framed on the sheet
Programming Connector: J401

### Ports
CONFIG (in, see 1), UART (bidir, harness UART, see 1), ~{RESET} (in, see 1)

### Harnesses
UART: CTS, RTS, TXD, RXD

### Nets
3V3_RF: C400.2 C401.2 J401.2 J401.9 R400.2 R401.2 U400.13(VCC) U400.41(VCC_PA)
GND: C400.1 C401.1 D400.K D401.K J400.2 J401.1 SW400.1 U400.1(GND) U400.7(GND) U400.8(GND) U400.10(GND) U400.14(GND)
~{RF_RESET}: J401.7 R402.1 ; port ~{RESET}
CONFIG: U400.4(Config) ; port CONFIG
RF_Antenna: J400.1 U400.9(RF)
RF_DC: J401.3 U400.20(DC)
RF_DD: J401.4 U400.19(DD)
RF_RXD: J401.5 U400.5(TXD) ; port UART.RXD
RF_TXD: J401.6 R401.1 U400.6(RXD) ; port UART.TXD
NetD400_A: D400.A R403.2
NetD401_A: D401.A R404.2
NetR400_1: R400.1 R402.2 SW400.2 U400.12(~{RESET})
NetR403_1: R403.1 U400.30(DBG-LED2)
NetR404_1: R404.1 U400.29(DBG-LED1)
NetU304_10: U400.3(RTS) ; port UART.CTS
NetU304_12: U400.2(CTS) ; port UART.RTS

Not connected (* = marked no-connect by the designer): J401 8* 10*; U400 11(VDD)*

### Layout directives
net class TXM: RF_Antenna
net class 3V3_RF: 3V3_RF, GND, RF_Antenna, RF_DC, RF_DD, RF_RXD, RF_TXD, ~{RF_RESET}

### Notes on the sheet
- Radio Module
- Info
- # RESET
  0 ohm Widerstand soll bei einem FW Update über die Programmer Schnittstelle entfernt werden.
  # VDD
  Interner Regulator Ausgang (NC)
- # Pull Up DNP
  Pull Up R platzieren, wenn RXD nicht an einem push-pull Ausgang und viel Umgebungsrauschen.
- # Transmission Line
  - Siehe AN061 Radiocraft PCB Layout
  - Siehe TI CC1120 Reference Design
- Capacitors close to VCC, VCC_PA
- Author
- Version
- Revision
- of

### Library data of the parts
C400 C401 = C: as C200 on sheet power; Mounting Technology: SM; Pins: 2; Case/Package: 0402; RoHS Compliant: True; Max Operating Temperature: 85°C; Component Type: Capacitors
D400 D401 = LED_1
R400-R404 = R?: Normaler Widerstand
SW400 = CMP-011-00011-1: Ultra-small Surface-mounting Tactile Switches with High Contact Reliability, SPST-NO, -25 to 70 degC, 2-Pin SMD, RoHS, Tape and Reel; Voltage Rating: 12V; RoHS Compliant: Details; Pins: 2
J401 = HEADER_5x2_LR: Supplier 1: Rs; Supplier Part Number 1: 2053212

## Sheet temperature.SchDoc
size A4; DocumentNumber: 5; SheetNumber: 5; SheetTotal: 7
Used 2 times, as channels TEMP1, TEMP2. Parts and nets are listed once, with the designators drawn on the sheet.
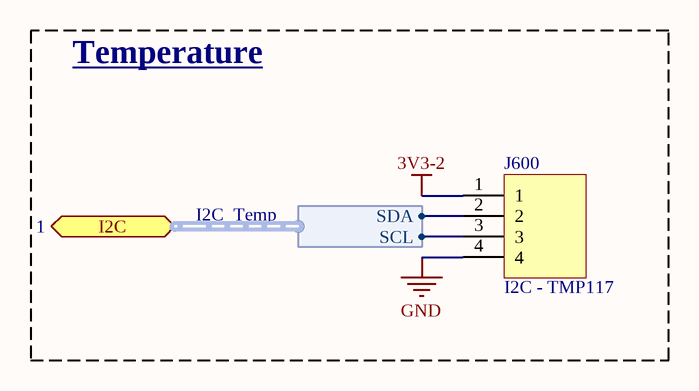
[diagram p4: temperature.SchDoc]

### Parts
J600  I2C - TMP117  [JST_S4B-PH-K-S(LF)(SN)]

### Blocks framed on the sheet
Temperature: J600

### Ports
I2C (bidir, harness I2C_Temp, see 1)

### Harnesses
I2C_Temp: SDA, SCL

### Nets
3V3-2: J600.1
GND: J600.4
NetJ600_2: J600.2 ; port I2C.SDA
NetJ600_3: J600.3 ; port I2C.SCL

### Channels
TEMP1: designators end in _TEMP1
TEMP2: designators end in _TEMP2

### Notes on the sheet
- Author
- Version
- Revision
- of

### Library data of the parts
J600 = CON4

## Sheet ios.SchDoc
size A4; DocumentNumber: 7; SheetNumber: 7; SheetTotal: 7
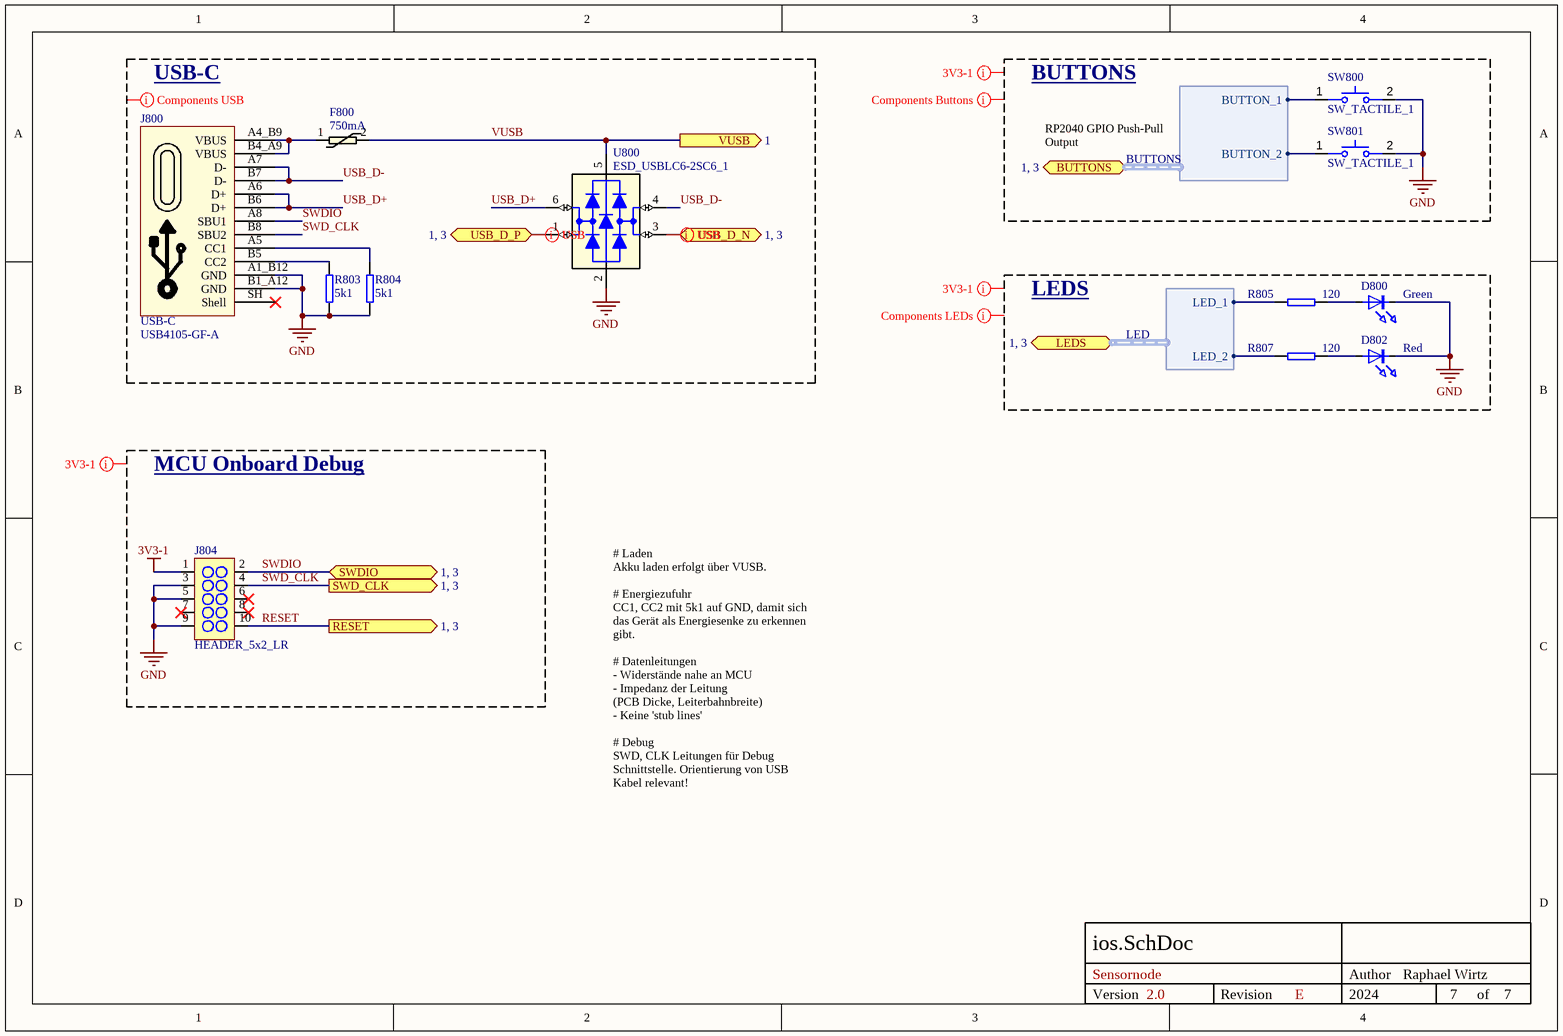
[diagram p5: ios.SchDoc]

### Parts
D800  Green  [0603-Diode]
D802  Red  [0603-Diode]
F800  750mA  [1206]
J800  USB-C  value USB4105-GF-A  [USB_GCT_4105-GF-A]
J804  HEADER_5x2_LR  [HEADER_SMD_1.27]
R803  5k1  [0603]
R804  5k1  [0603]
R805  120  [0603]
R807  120  [0603]
SW800  SW_TACTILE_1  [SWITCH_B3FS1010P]
SW801  SW_TACTILE_1  [SWITCH_B3FS1010P]
U800  ESD_USBLC6-2SC6_1  [SOT95P280X145-6N]

### Ports
BUTTONS (bidir, harness BUTTONS, see 1, 3), LEDS (bidir, harness LED, see 1, 3), RESET (out, see 1, 3), SWD_CLK (out, see 1, 3), SWDIO (bidir, see 1, 3), USB_D_N (bidir, see 1, 3), USB_D_P (bidir, see 1, 3), VUSB (out, see 1)

### Harnesses
LED: LED_2, LED_1
BUTTONS: BUTTON_2, BUTTON_1

### Nets
3V3-1: J804.1
GND: D800.K D802.K J800.A1_B12(GND) J800.B1_A12(GND) J804.3 J804.5 J804.9 R803.1 R804.1 SW800.2 SW801.2 U800.2(GND)
BUTTON_1: SW800.1 ; port BUTTONS.BUTTON_1
BUTTON_2: SW801.1 ; port BUTTONS.BUTTON_2
LED_1: R805.2 ; port LEDS.LED_1
LED_2: R807.2 ; port LEDS.LED_2
RESET: J804.10 ; port RESET
SWD_CLK: J800.B8(SBU2) J804.4 ; port SWD_CLK
SWDIO: J800.A8(SBU1) J804.2 ; port SWDIO
USB_D+: J800.A6(D+) J800.B6(D+) U800.6(I/O1_OUT)
USB_D-: J800.A7(D-) J800.B7(D-) U800.4(I/O2_OUT)
USB_D_N: U800.3(I/O2_IN) ; port USB_D_N
USB_D_P: U800.1(I/O1_IN) ; port USB_D_P
VUSB: F800.2 U800.5(VBUS) ; port VUSB  [project net V_USB]
NetD800_A: D800.A R805.1
NetD802_A: D802.A R807.1
NetF800_1: F800.1 J800.A4_B9(VBUS) J800.B4_A9(VBUS)
NetJ800_A5: J800.A5(CC1) R804.2
NetJ800_B5: J800.B5(CC2) R803.2

Not connected (* = marked no-connect by the designer): J800 SH(Shell)*; J804 6* 7* 8*

### Layout directives
net class 3V3-1: 3V3-1, GND, RESET, SWD_CLK, SWDIO
CompClassName: IO_USB: GND, SWD_CLK, SWDIO, USB_D+, USB_D-, VUSB
CompClassName: IO_BUTTONS: GND
CompClassName: IO_LEDS: GND
differential pair: USB_D_N, USB_D_P

### Notes on the sheet
- USB-C
- BUTTONS
- RP2040 GPIO Push-Pull Output
- LEDS
- MCU Onboard Debug
- # Laden
  Akku laden erfolgt über VUSB.
  # Energiezufuhr
  CC1, CC2 mit 5k1 auf GND, damit sich das Gerät als Energiesenke zu erkennen gibt.
  # Datenleitungen
  - Widerstände nahe an MCU
  - Impedanz der Leitung
  (PCB Dicke, Leiterbahnbreite)
  - Keine 'stub lines'
  # Debug
  SWD, CLK Leitungen für Debug Schnittstelle. Orientierung von USB Kabel relevant!
- Author
- Version
- Revision
- of

### Library data of the parts
D800 D802 = LED_1
F800 = FUSE_1: Resettable Fuse
J800 = USB-C_2: Connector 24 (16+8 Dummy)
R803-R805 R807 = R?: Normaler Widerstand
  R805 R807: Value: 120
U800 = ESD_USBLC6-2SC6_1: 17V Clamp 5A (8/20Âµs) Ipp Tvs Diode Surface Mount SOT-23-6; MF: STMicroelectronics; Value: *; SnapEDA_Link: https://www.snapeda.com/parts/USBLC6-2SC6/STMicroelectronics/view-part/?ref=snap; Check_prices: https://www.snapeda.com/parts/USBLC6-2SC6/STMicroelectronics/view-part/?ref=eda; Purchase-URL: https://pricing.snapeda.com/search/part/USBLC6-2SC6/?ref=eda; Price: None; Availability: In Stock; Package: SOT-23-6 STMicroelectronics; MP: USBLC6-2SC6

## Nets that join several sheets
3V3: mcu (C318.2 R303.1 R304.1 U300.7), power (13 pins)
3V3-1: mcu (29 pins), power (J201.2), ios (J804.1)
3V3-2: mcu (R308.1 R309.1), power (J202.2), TEMP1 (J600_TEMP1.1), TEMP2 (J600_TEMP2.1)
3V3_RF: mcu (C314.1 C316.1 U303.7 U304.14), power (J204.2), radio (8 pins)
GND: mcu (28 pins), power (33 pins), radio (12 pins), TEMP1 (J600_TEMP1.4), TEMP2 (J600_TEMP2.4), ios (12 pins)
~{RF_RESET}: mcu (U303.8), radio (J401.7 R402.1)
BUTTON_1: mcu (U301.17), ios (SW800.1)
BUTTON_2: mcu (U301.18), ios (SW801.1)
CONFIG: mcu (U303.1), radio (U400.4)
I2C1_SCL: mcu (R309.2 U301.30), TEMP1 (J600_TEMP1.3), TEMP2 (J600_TEMP2.3)
I2C1_SDA: mcu (R308.2 U301.29), TEMP1 (J600_TEMP1.2), TEMP2 (J600_TEMP2.2)
LED_1: mcu (U301.28), ios (R805.2)
LED_2: mcu (U301.27), power (U203.1), ios (R807.2)
NetR303_2: mcu (R303.2 TP300.1 U300.8), power (U205.7)
NetR304_2: mcu (R304.2 TP301.1 U300.1), power (U205.6)
NetU304_10: mcu (U304.10), radio (U400.3)
NetU304_12: mcu (U304.12), radio (U400.2)
POWER_3V3_PS: mcu (U301.12), power (R207.2 U201.2)
RESET: mcu (U301.26), ios (J804.10)
RF_RXD: mcu (U304.11), radio (J401.5 U400.5)
RF_TXD: mcu (U304.13), radio (J401.6 R401.1 U400.6)
SWD_CLK: mcu (U301.24), ios (J800.B8 J804.4)
SWDIO: mcu (U301.25), ios (J800.A8 J804.2)
USB_D_N: mcu (R307.2), ios (U800.3)
USB_D_P: mcu (R306.2), ios (U800.1)
V_USB: power (C200.2 D200.A R200.2 U200.1), ios (F800.2 U800.5)